# EAGLE design USB-to-UART (EAGLE 9.6.2)
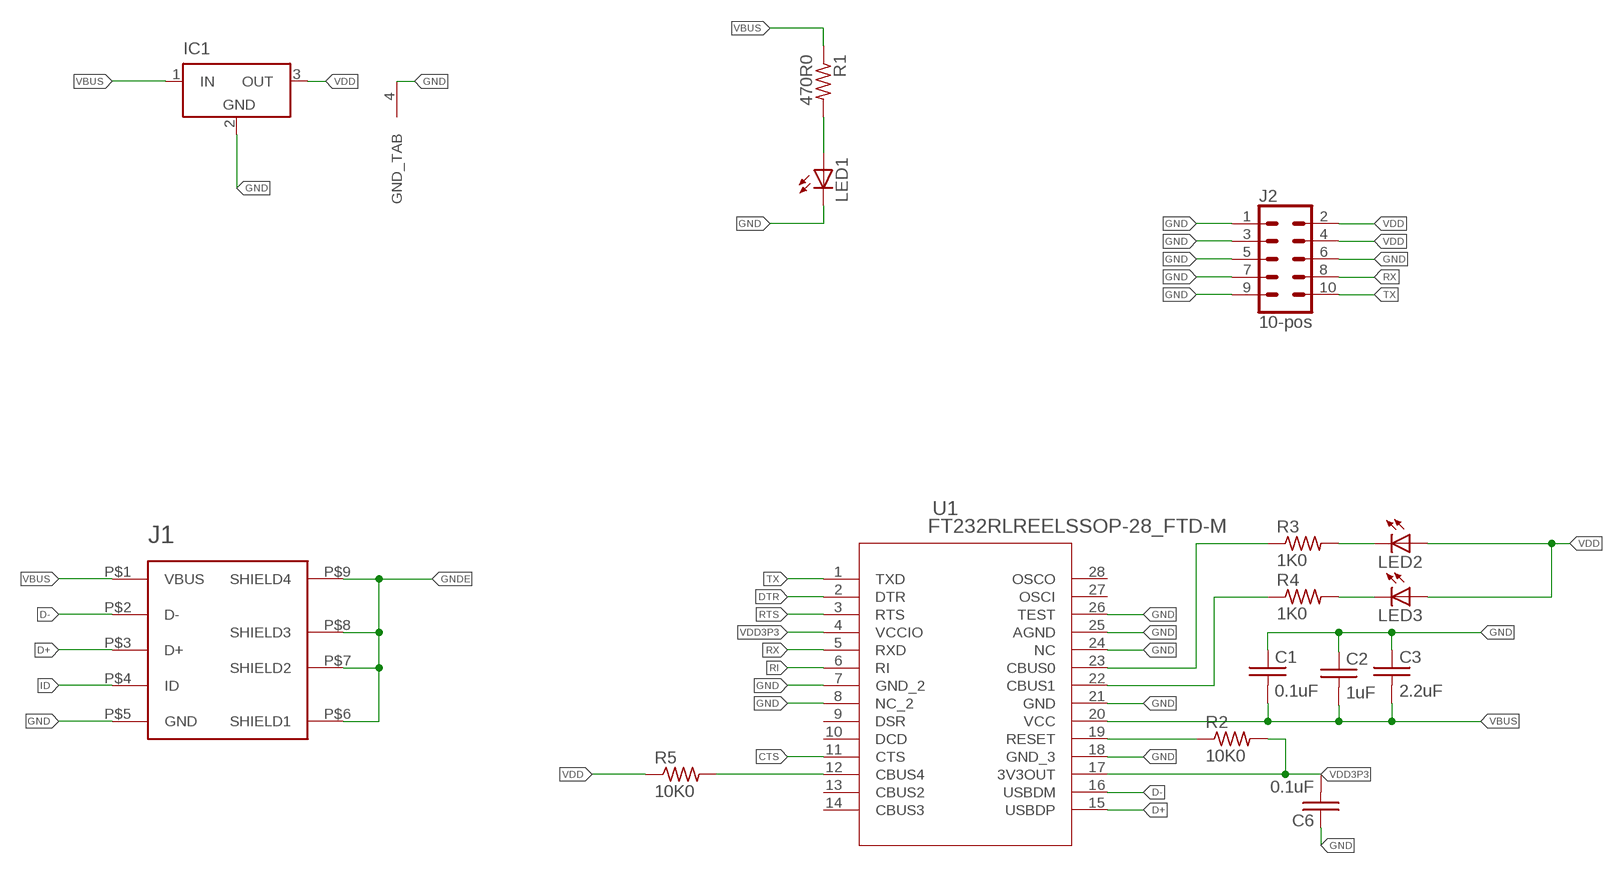
[diagram p0: schematic, sheet 1]

## Parts
C1  0.1uF  C_0402_0.1UF  [0402]
C2  1uF  C_0402_1UF  [0402]
C3  2.2uF  C_0402_2.2UF  [0402]
C6  0.1uF  C_0402_0.1UF  [0402]
IC1  LT1129CST3  [SOT223]
J1  USB-B-Micro  USB_MICRO-B  [USB_MICRO-B]
J2  10-pos  CONN_05X2_RAPTH  [2X5]
LED1  Green  LED_0805_GREEN  [LED_0805_GREEN]
LED2  Green  LED_0805_GREEN  [LED_0805_GREEN]
LED3  Green  LED_0805_GREEN  [LED_0805_GREEN]
R1  470R0  R_0402_470R0  [0402]
R2  10K0  R_0402_10K0  [0402]
R3  1K0  R_0402_1K0  [0402]
R4  1K0  R_0402_1K0  [0402]
R5  10K0  R_0402_10K0  [0402]
U1  FT232RLREELSSOP-28_FTD-M  [SSOP-28_FTD-M]

## Nets
CTS: U1.11(CTS)
D+: J1.P$3(D+) U1.15(USBDP)
D-: J1.P$2(D-) U1.16(USBDM)
DTR: U1.2(DTR)
GND: C1.P$1 C2.P$1 C3.P$1 C6.P$1 IC1.2(GND) IC1.4(GND_TAB) J1.P$5(GND) J2.1 J2.3 J2.5 J2.6 J2.7 J2.9 LED1.C U1.7(GND_2) U1.8(NC_2) U1.18(GND_3) U1.21(GND) U1.24(NC) U1.25(AGND) U1.26(TEST)
GNDE: J1.P$6(SHIELD1) J1.P$7(SHIELD2) J1.P$8(SHIELD3) J1.P$9(SHIELD4)
ID: J1.P$4(ID)
N$1: LED1.A R1.P$2
N$2: R2.P$1 U1.19(RESET)
N$3: R3.P$1 U1.23(CBUS0)
N$4: LED2.C R3.P$2
N$11: R4.P$1 U1.22(CBUS1)
N$12: LED3.C R4.P$2
N$13: R5.P$2 U1.12(CBUS4)
RI: U1.6(RI)
RTS: U1.3(RTS)
RX: J2.8 U1.5(RXD)
TX: J2.10 U1.1(TXD)
VBUS: C1.P$2 C2.P$2 C3.P$2 IC1.1(IN) J1.P$1(VBUS) R1.P$1 U1.20(VCC)
VDD: IC1.3(OUT) J2.2 J2.4 LED2.A LED3.A R5.P$1
VDD3P3: C6.P$2 R2.P$2 U1.4(VCCIO) U1.17(3V3OUT)
Unconnected: U1.9(DSR) U1.10(DCD) U1.13(CBUS2) U1.14(CBUS3) U1.27(OSCI) U1.28(OSCO)

## Library data of the parts
C1 C6 = 3D_MIG_Controller:C_0402_0.1UF; PARTNO: CL05F104ZO5NNNC
C2 = 3D_MIG_Controller:C_0402_1UF; PARTNO: CL05A105KO5NNNC
C3 = 3D_MIG_Controller:C_0402_2.2UF; PARTNO: GRM155C81C225ME15D
IC1 = 3D_MIG_Controller:LT1129CST3: VOLTAGE REGULATOR with shutdown
J1 = 3D_MIG_Controller:USB_MICRO-B; PARTNO: 10118192-0002LF
J2 = 3D_MIG_Controller:CONN_05X2_RA: Connector Header Through Hole, Right Angle 10 position 0.100" (2.54mm); PARTNO: PH2RA-10-UA
LED1-LED3 = 3D_MIG_Controller:LED_0805_GREEN: Green 570nm LED Indication - Discrete 2.2V 0805 (2012 Metric); PARTNO: LG R971-KN-1
R1 = 3D_MIG_Controller:R_0402_470R0; PARTNO: RMCF0402JT470R
R2 R5 = 3D_MIG_Controller:R_0402_10K0; PARTNO: RMCF0402JT10K0
R3 R4 = 3D_MIG_Controller:R_0402_1K0; PARTNO: CRG0402J1K0
U1 = 3D_MIG_Controller:FT232RLREEL; BUILT_BY: EMA_Cory; COPYRIGHT: Copyright (C) 2018 Accelerated Designs. All rights reserved; DATASHEET: https://www.ftdichip.com/Support/Documents/DataSheets/ICs/DS_FT232R.pdf; MANUFACTURER_PART_NUMBER: FT232RLREEL; SOURCELIBRARY: FTDI_2020-06-08; VENDOR: FTDI

## Board
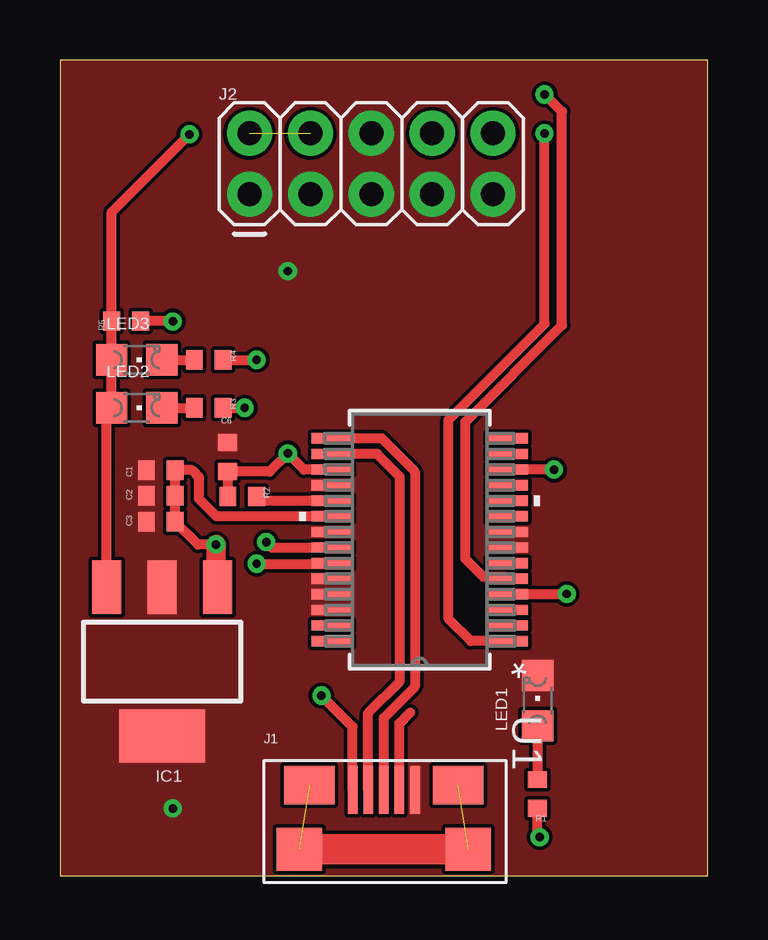
[diagram p1: board, top side]
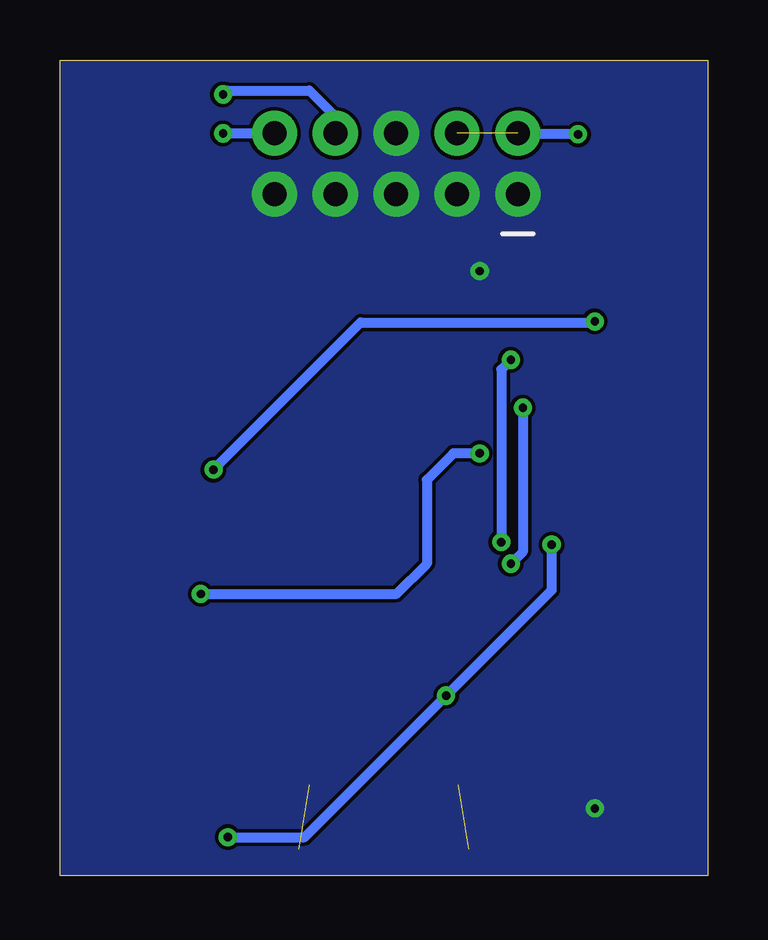
[diagram p2: board, bottom side, seen from below]

Size 27 x 34 mm. Coordinates in mm from the lower left corner, seen from the top.
Outline: 0,0 27,0 27,34 0,34 0,0
Copper layers (1*16): Top 0.035mm / dielectric 1.5mm / Bottom 0.035mm
Design rules "default *": minimum track width 6mil, minimum drill 0.35mm, track to track 6mil, track to pad 6mil, pad to pad 6mil, via to via 6mil, smd to smd 6mil, copper to edge 1mil, drill to drill 6mil, minimum pad ring 10mil, minimum via ring 8mil, stop-mask expansion 4mil, vias tented up to drill 0mil, thermal gap 10mil

### Footprints (pad centres in the part's own frame; a part is rotated, then mirrored left to right if it is on the bottom)
0402 = smd 0.8 x 0.7: P$1 0,0.6; P$2 0,-0.6
SOT223 = smd 1.219 x 2.235: 1 -2.311,-3.099; 2 0,-3.099; 3 2.311,-3.099 | smd 3.6 x 2.2: 4 0,3.099
USB_MICRO-B = smd 0.4 x 2: P$1 -1.3,2.475; P$2 -0.65,2.475; P$3 0,2.475; P$4 0.65,2.475; P$5 1.3,2.475 | smd 2.1 x 1.6: P$6 -3.1,2.675; P$7 3.1,2.675 | smd 1.9 x 1.8: P$8 -3.525,0; P$9 3.525,0
2X5 = drill 1 pad 1.88: 1 0,0; 2 0,2.54; 3 2.54,0; 4 2.54,2.54; 5 5.08,0; 6 5.08,2.54; 7 7.62,0; 8 7.62,2.54; 9 10.16,0; 10 10.16,2.54
LED_0805_GREEN = smd 1.3 x 1.3: A 0,-1.05; C 0,1.05
SSOP-28_FTD-M = smd 1.714 x 0.432: 1 -3.651,4.225; 2 -3.651,3.575; 3 -3.651,2.925; 4 -3.651,2.275; 5 -3.651,1.625; 6 -3.651,0.975; 7 -3.651,0.325; 8 -3.651,-0.325; 9 -3.651,-0.975; 10 -3.651,-1.625; 11 -3.651,-2.275; 12 -3.651,-2.925; 13 -3.651,-3.575; 14 -3.651,-4.225; 15 3.651,-4.225; 16 3.651,-3.575; 17 3.651,-2.925; 18 3.651,-2.275; 19 3.651,-1.625; 20 3.651,-0.975; 21 3.651,-0.325; 22 3.651,0.325; 23 3.651,0.975; 24 3.651,1.625; 25 3.651,2.275; 26 3.651,2.925; 27 3.651,3.575; 28 3.651,4.225

### Placement (x,y rotation side)
C1  4.2,16.9 90 top
C2  4.2,15.83 90 top
C3  4.2,14.75 90 top
C6  6.99,17.45 0 top
IC1  4.26,8.92 180 top
J1  13.5,1.1 0 top
J2  7.9,28.4 0 top
LED1  19.92,7.29 0 top
LED2  3.2,19.5 270 top
LED3  3.2,21.5 270 top
R1  19.9,3.4 180 top
R2  7.6,15.8 270 top
R3  6.2,19.5 270 top
R4  6.2,21.5 270 top
R5  2.76,23.11 90 top
U1  15,14 180 top

### Tracks (layer width: path | path; a pad name or v marks a point on that pad's centre or on a via)
D+
  Top 0.406: J1.P$3 13.5,6.58 14.8,7.88 14.8,16.84 13.42,18.23 U1.15
D-
  Top 0.406: J1.P$2 12.85,6.78 14.15,8.07 14.15,16.64 13.22,17.57 U1.16
GND  (via drill 0.35)
  other vias: 4.7,2.8 9.5,25.2
  pour Top (no thermals): 0,34 27,34 27,0 0,0
  pour Bottom (no thermals): 0,34 27,34 27,0 0,0
GNDE  (2 unrouted)
  Top 1.27: J1.P$8 J1.P$9
ID
  Top 0.406: J1.P$4 14.15,6.35 14.6,6.8
N$1
  Top 0.406: LED1.A 19.9,6.22 R1.P$2
N$2
  Top 0.406: U1.19 8.38,15.62 R2.P$1
N$3  (via drill 0.35)
  Top 0.406: R3.P$1 v7.7,19.5 | v8.2,13 11.32,13 U1.23
  Bottom 0.406: v7.7,19.5 7.7,13.5 v8.2,13
N$4
  Top 0.406: LED2.C R3.P$2
N$11  (via drill 0.35)
  Top 0.406: R4.P$1 v8.2,21.5 | v8.6,13.9 8.82,13.68 U1.22
  Bottom 0.406: v8.2,21.5 8.6,21.1 v8.6,13.9
N$12
  Top 0.406: LED3.C R4.P$2
N$13  (via drill 0.35)
  Top 0.406: v4.7,23.1 v4.69,23.11 R5.P$2 | v20.6,16.92 U1.12
  Bottom 0.406: v4.7,23.1 4.74,23.06 14.46,23.06 v20.6,16.92
RX  (via drill 0.35)
  Top 0.406: U1.5 18.57,12.45 17.65,12.45 16.9,13.2 16.9,18.91 20.93,22.94 20.93,31.85 20.23,32.56 v20.2,32.56
  Bottom 0.406: v20.2,32.56 20.04,32.72 16.6,32.72 15.52,31.64 J2.8
TX  (via drill 0.35)
  Top 0.406: U1.1 17.12,9.78 16.2,10.7 16.2,19 20.2,23 v20.2,30.94
  Bottom 0.406: v20.2,30.94 J2.10
VBUS  (via drill 0.35)
  Top 0.406: J1.P$1 12.2,6.2 v10.9,7.5 | v20,1.6 19.9,1.7 R1.P$1 | U1.20 6.53,14.97 5.8,15.7 5.8,16.6 5.5,16.9 C1.P$2 C2.P$2 C3.P$2 5.75,13.8 v6.5,13.8
  Top 0.813: IC1.1 6.5,12.09 v6.5,13.8
  Bottom 0.406: v6.5,13.8 6.5,11.9 v10.9,7.5 16.8,1.6 v20,1.6
VDD  (via drill 0.35)  (1 unrouted)
  Top 0.406: IC1.3 1.95,19.3 LED2.A LED3.A | 2.15,21.7 LED3.A | LED3.A R5.P$1 2.16,27.66 v5.4,30.9
  Bottom 0.406: v5.4,30.9 7.86,30.9 J2.2
VDD3P3  (via drill 0.35)
  Top 0.406: U1.17 10.18,16.93 v9.5,17.6 8.74,16.84 C6.P$2 | v21.13,11.74 21.11,11.72 U1.4 | R2.P$2 C6.P$2 | C6.P$2
  Bottom 0.406: v21.13,11.74 12.96,11.74 11.7,13 11.7,16.5 10.6,17.6 v9.5,17.6